# Altium schematic sheet Power.SchDoc
size A4
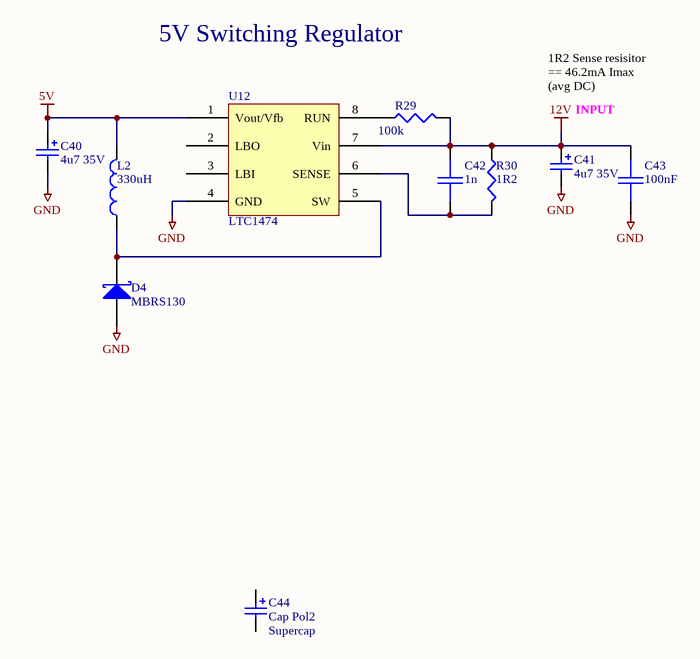
[diagram p0: Power.SchDoc]

## Parts
C40  4u7 35V  [MCCT-CASEC]
C41  4u7 35V  [MCCT-CASEC]
C42  1n  [0603]
C43  100nF  [0603]
C44  Cap Pol2  value Supercap  [CAPPA14.05-10.5x6.3]
D4  MBRS130  [SMB]
L2  330uH  [1812]
R29  100k  [0603]
R30  1R2  [0603]
U12  LTC1474  [TSOP8]

## Nets
5V: C40.1 L2.2 U12.1(Vout/Vfb)
12V: C41.1 C42.1 C43.1 R29.2 R30.1 U12.7(Vin)
GND: C40.2 C41.2 C43.2 D4.A U12.4(GND)
NetC42_2: C42.2 R30.2 U12.6(SENSE)
NetD4_K: D4.K L2.1 U12.5(SW)
NetR29_1: R29.1 U12.8(RUN)

Not connected (* = marked no-connect by the designer): C44 1 2; U12 2(LBO) 3(LBI)

## Notes on the sheet
- 5V Switching Regulator
- 1R2 Sense resisitor == 46.2mA Imax (avg DC)
- INPUT

## Library data of the parts
C40 C41 = Cap Pol3: Polarized Capacitor (Surface Mount); Value: 4.7uF; Order#: 197-609; Revision: July-2002: Re-released for DXP Platform.; Price: 1.41; Supplier: Farnell
C42 = CAP: Capacitor; Value: 1nF; Order#: 317-202; Revision: July-2002: Re-released for DXP Platform.; Price: 0.15; Supplier: Farnell
C43 = CAP: Capacitor; Value: 0.1uF; Order#: 753-567; Revision: July-2002: Re-released for DXP Platform.; Price: 0.31; Supplier: Farnell
C44 = Cap Pol2: Polarized Capacitor (Axial); Published: 8-Jun-2000; LatestRevisionDate: 17-Jul-2002; LatestRevisionNote: Re-released for DXP Platform.; PackageReference: POLAR0.8; Publisher: Altium Limited
D4 = D SCHOTTKY: Schottky Diode; Order#: 9556931; Revision: July-2002: Re-released for DXP Platform.; Price: 1.49; Supplier: Farnell
L2 = Inductor: Order#: 8808538; Revision: July-2002: Re-released for DXP Platform.; Value: 330uH; Price: 1.96; Supplier: Farnell
R29 = RES1: Resistor; Order#: 933-3738; Value: 100k; Price: 0.13; Supplier: Farnell
R30 = RES1: Resistor; Value: 1.2R; Order#: 139-9658; Revision: July-2002: Re-released for DXP Platform.; Price: 0.63; Supplier: Farnell
U12 = LTC1474: Step-down converter; Order#: LTC1474CMS8-3.3-ND; Price: 7.50USD; Supplier: Digikey